# EAGLE design breakout_lpc11c24 (EAGLE 5.12)
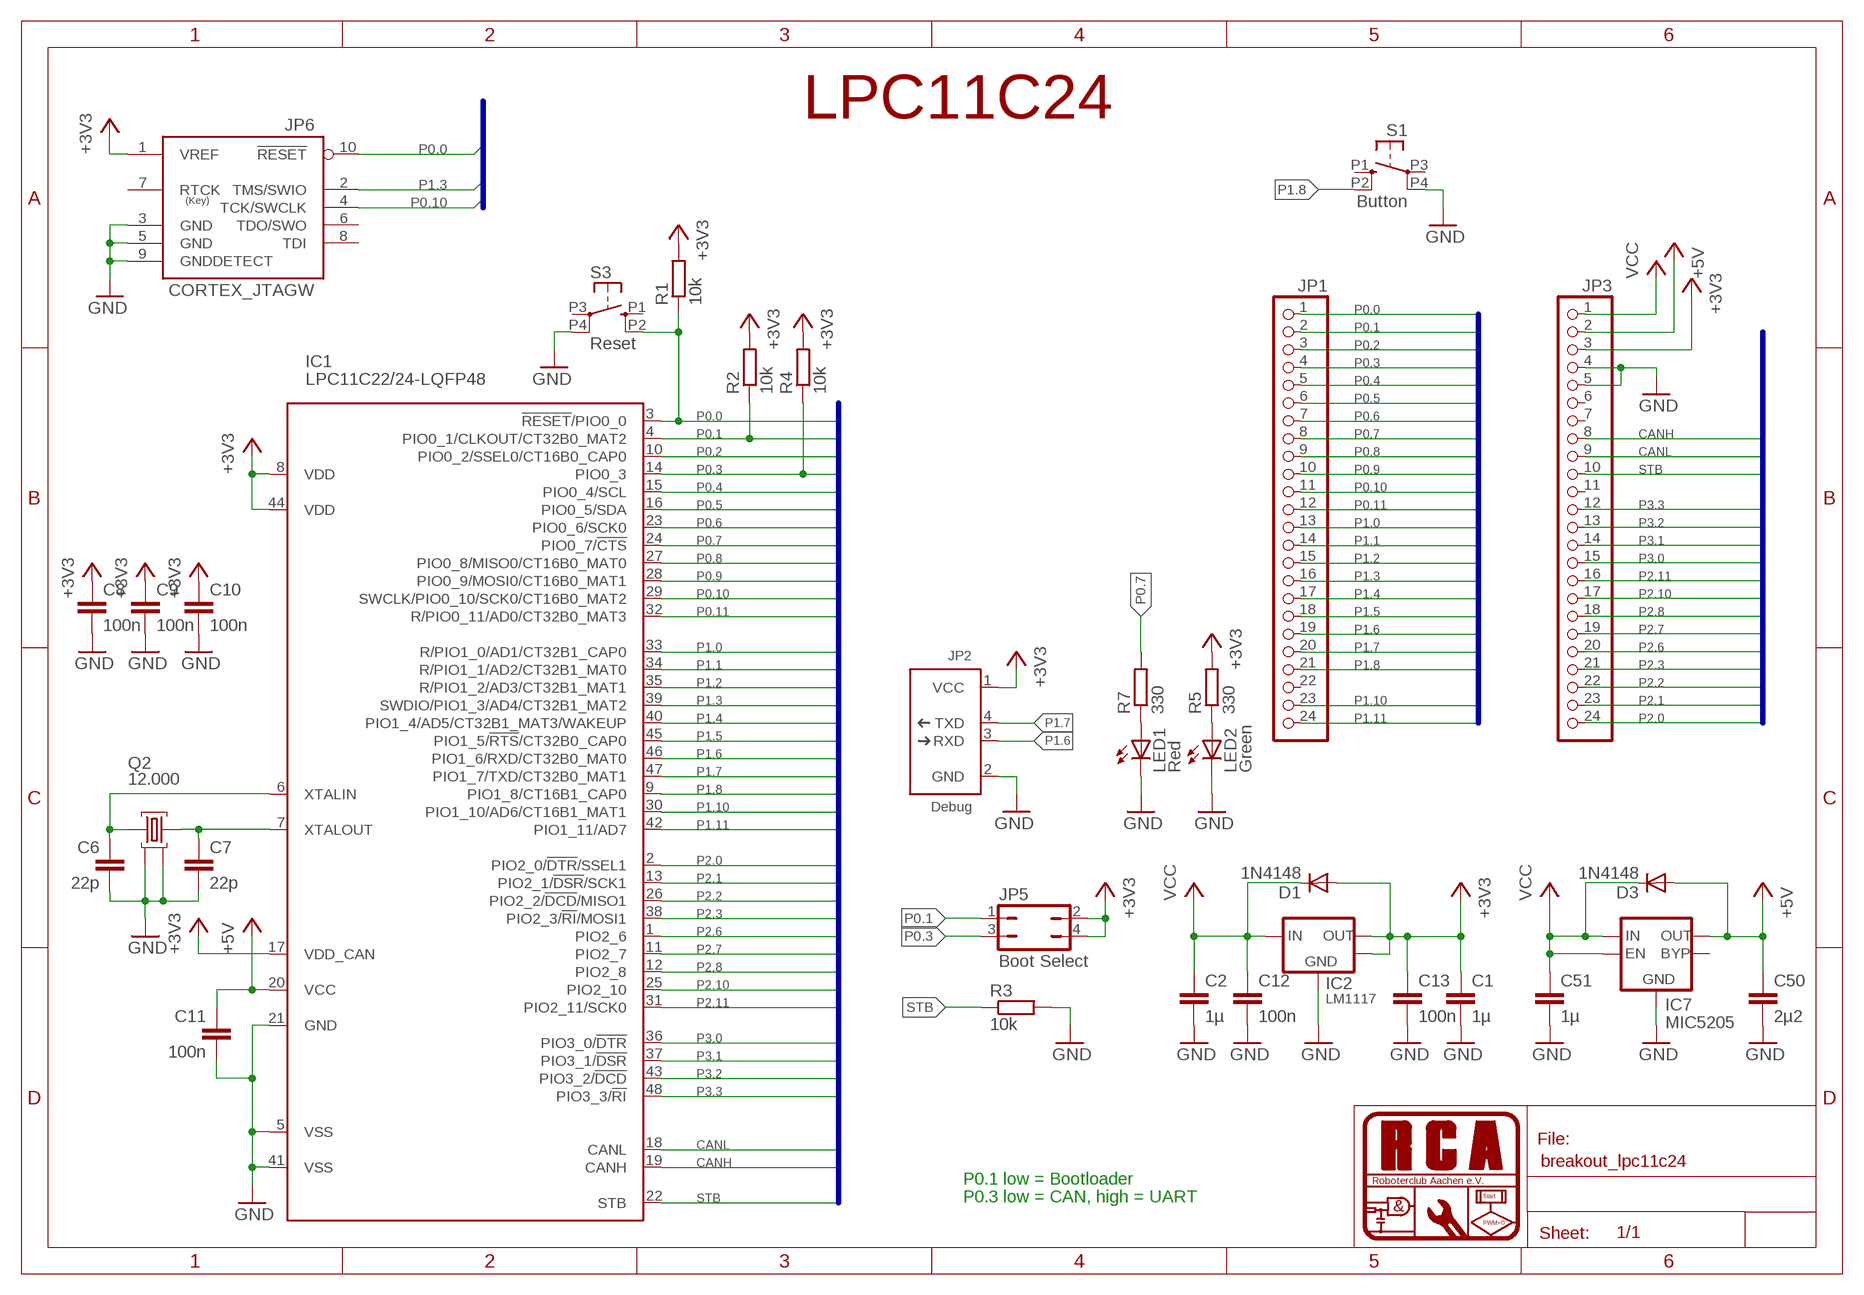
[diagram p0: schematic, sheet 1]

## Parts
C1  1µ  C-EUC0805  [C0805]
C2  1µ  C-EUC0805  [C0805]
C6  22p  C-EUC0805  [C0805]
C7  22p  C-EUC0805  [C0805]
C8  100n  C-EUC0603  [C0603]
C9  100n  C-EUC0603  [C0603]
C10  100n  C-EUC0603  [C0603]
C11  100n  C-EUC0603  [C0603]
C12  100n  C-EUC0603  [C0603]
C13  100n  C-EUC0603  [C0603]
C50  2µ2  C-EUC0805  [C0805]
C51  1µ  C-EUC0805  [C0805]
D1  1N4148  DIODE-SOD80C  [SOD80C]
D3  1N4148  DIODE-SOD80C  [SOD80C]
IC1  LPC11C22/24-LQFP48  [LQFP48]
IC2  LM1117  [SOT223]
IC7  MIC5205  [SOT23-5L]
JP1  PINHD-1X24_2.54  [1X24]
JP2  Debug  SERIAL-DEBUGPSL  [7395-05]
JP3  PINHD-1X24_2.54  [1X24]
JP5  Boot Select  JP2Q  [JP2Q]
JP6  CORTEX_JTAGW  [ML10]
LED1  Red  LEDCHIPLED_0805  [CHIPLED_0805]
LED2  Green  LEDCHIPLED_0805  [CHIPLED_0805]
Q2  12.000  MT  [MT]
R1  10k  R-EU_R0805  [R0805]
R2  10k  R-EU_R0805  [R0805]
R3  10k  R-EU_R0805  [R0805]
R4  10k  R-EU_R0805  [R0805]
R5  330  R-EU_R0805  [R0805]
R7  330  R-EU_R0805  [R0805]
S1  Button  10-XXLSH  [B3F-10XX-SMD]
S3  Reset  10-XXLSH  [B3F-10XX-SMD]

## Nets
+3V3: C1.1 C8.1 C9.1 C10.1 C13.1 D1.A IC1.8(VDD) IC1.17(VDD_CAN) IC1.44(VDD) IC2.2(OUT) IC2.4(OUT) JP2.1(VCC) JP3.3 JP5.2 JP5.4 JP6.1(VREF) R1.2 R2.2 R4.2 R5.2
+5V: C11.1 C50.1 D3.A IC1.20(VCC) IC7.5(OUT) JP3.2
CANH: IC1.19(CANH) JP3.8
CANL: IC1.18(CANL) JP3.9
GND: C1.2 C2.2 C6.2 C7.2 C8.2 C9.2 C10.2 C11.2 C12.2 C13.2 C50.2 C51.2 IC1.5(VSS) IC1.21(GND) IC1.41(VSS) IC2.1(GND) IC7.2(GND) JP2.2(GND) JP3.4 JP3.5 JP6.3(GND) JP6.5(GND) JP6.9(GNDDETECT) LED1.C LED2.C Q2.2(GND) Q2.4(GND) R3.2 S1.P4(P1) S3.P4(P1)
N$1: C7.1 IC1.7(XTALOUT) Q2.3
N$2: LED2.A R5.1
N$4: LED1.A R7.1
N$9: C6.1 IC1.6(XTALIN) Q2.1
P0.0: IC1.3(!RESET!/PIO0_0) JP1.1 JP6.10(!RESET) R1.1 S3.P2(S1)
P0.1: IC1.4(PIO0_1/CLKOUT/CT32B0_MAT2) JP1.2 JP5.1 R2.1
P0.2: IC1.10(PIO0_2/SSEL0/CT16B0_CAP0) JP1.3
P0.3: IC1.14(PIO0_3) JP1.4 JP5.3 R4.1
P0.4: IC1.15(PIO0_4/SCL) JP1.5
P0.5: IC1.16(PIO0_5/SDA) JP1.6
P0.6: IC1.23(PIO0_6/SCK0) JP1.7
P0.7: IC1.24(PIO0_7/!CTS!) JP1.8 R7.2
P0.8: IC1.27(PIO0_8/MISO0/CT16B0_MAT0) JP1.9
P0.9: IC1.28(PIO0_9/MOSI0/CT16B0_MAT1) JP1.10
P0.10: IC1.29(SWCLK/PIO0_10/SCK0/CT16B0_MAT2) JP1.11 JP6.4(TCK/SWCLK)
P0.11: IC1.32(R/PIO0_11/AD0/CT32B0_MAT3) JP1.12
P1.0: IC1.33(R/PIO1_0/AD1/CT32B1_CAP0) JP1.13
P1.1: IC1.34(R/PIO1_1/AD2/CT32B1_MAT0) JP1.14
P1.2: IC1.35(R/PIO1_2/AD3/CT32B1_MAT1) JP1.15
P1.3: IC1.39(SWDIO/PIO1_3/AD4/CT32B1_MAT2) JP1.16 JP6.2(TMS/SWIO)
P1.4: IC1.40(PIO1_4/AD5/CT32B1_MAT3/WAKEUP) JP1.17
P1.5: IC1.45(PIO1_5/!RTS!/CT32B0_CAP0) JP1.18
P1.6: IC1.46(PIO1_6/RXD/CT32B0_MAT0) JP1.19 JP2.3(RXD)
P1.7: IC1.47(PIO1_7/TXD/CT32B0_MAT1) JP1.20 JP2.4(TXD)
P1.8: IC1.9(PIO1_8/CT16B1_CAP0) JP1.21 S1.P2(S1)
P1.10: IC1.30(PIO1_10/AD6/CT16B1_MAT1) JP1.23
P1.11: IC1.42(PIO1_11/AD7) JP1.24
P2.0: IC1.2(PIO2_0/!DTR!/SSEL1) JP3.24
P2.1: IC1.13(PIO2_1/!DSR!/SCK1) JP3.23
P2.2: IC1.26(PIO2_2/!DCD!/MISO1) JP3.22
P2.3: IC1.38(PIO2_3/!RI!/MOSI1) JP3.21
P2.6: IC1.1(PIO2_6) JP3.20
P2.7: IC1.11(PIO2_7) JP3.19
P2.8: IC1.12(PIO2_8) JP3.18
P2.10: IC1.25(PIO2_10) JP3.17
P2.11: IC1.31(PIO2_11/SCK0) JP3.16
P3.0: IC1.36(PIO3_0/!DTR!) JP3.15
P3.1: IC1.37(PIO3_1/!DSR!) JP3.14
P3.2: IC1.43(PIO3_2/!DCD!) JP3.13
P3.3: IC1.48(PIO3_3/!RI!) JP3.12
STB: IC1.22(STB) JP3.10 R3.1
VCC: C2.1 C12.1 C51.1 D1.C D3.C IC2.3(IN) IC7.1(IN) IC7.3(EN) JP3.1
Unconnected: IC7.4(BYP) JP1.22 JP3.6 JP3.7 JP3.11 JP6.6(TDO/SWO) JP6.7(RTCK) JP6.8(TDI) S1.P1(S) S1.P3(P) S3.P1(S) S3.P3(P)

## Buses
P0.[0..11],P1.[0..8],P1.[10..11],P2.[0..3],P2.[6..8],P2.[10..11],P3.[0..3],CANH,CANL,STB

## Notes on the sheet
- LPC11C24
- P0.1 low = Bootloader
- P0.3 low = CAN, high = UART

## Library data of the parts
C1 C2 C6-C13 C50 C51 = rcl:C-EU: CAPACITOR, European symbol
D1 D3 = diode:DIODE-: DIODE
IC1 = lpc1100v1.1:LPC11C22/24-LQFP48: NXP Semiconductors LPC11Cxx microcontrollers <http://ics.nxp.com/products/lpc1000/lpc11xx/lpc11cxx/> ARM 32-bit Cortex-M0 Microcontroller with MPU CPU clock up to 50MHz 32KByte on-chip Flash ROM with In-System Programming (ISP) and In-Application Programming (IAP) via On-Chip Bootloader 8KByte SRAM Nested Vectored Interrupt Controller 2 SPI controllers CAN controller On-chip, high-speed CAN transciever UART with full Modem Interface and RS485 Support Fast Mode I2C-Bus 4 Timers with 4 capture channels and 12 output channels Watchdog (WDT) Sytem tick timer 10-bit ADC with 8 channels Power Management Unit (PMU) Brownout detection 12MHz internal RC oscillator Serial Wire Debug/Trace port
IC2 = rca_spgversorgung:LM1117: LM1117 800mA Low-Dropout Linear Regulator
IC7 = rca_spgversorgung:MIC5205: MIC5205 150mA Low-Noise LDO Regulator The MIC5205 is an efficient linear voltage regulator with ultra low-noise output, very low dropout voltage (typically 17mV at light loads and 165mV at 150mA), and very low ground current (600µA at 100mA output). The MIC5205 offers better than 1% initial accuracy.
JP1 JP3 = pinhead2:PINHD-1X24: PIN HEADER
JP2 = rca_stecker:SERIAL-DEBUG: Serieller Debugging Stecker Die RXD und TXD Leitungen sollten 5V Pegel haben
JP5 = jumper:JP2Q: JUMPER
JP6 = rca_stecker:CORTEX_JTAG
LED1 LED2 = led:LED: LED OSRAM: - CHIPLED LG R971, LG N971, LY N971, LG Q971, LY Q971, LO R971, LY R971 LH N974, LH R974 LS Q976, LO Q976, LY Q976 LO Q996 - Hyper CHIPLED LW Q18S LB Q993, LB Q99A, LB R99A - SideLED LS A670, LO A670, LY A670, LG A670, LP A670 LB A673, LV A673, LT A673, LW A673 LH A674 LY A675 LS A676, LA A676, LO A676, LY A676, LW A676 LS A679, LY A679, LG A679 - Hyper Micro SIDELED® LS Y876, LA Y876, LO Y876, LY Y876 LT Y87S - SmartLED LW L88C, LW L88S LB L89C, LB L89S, LG L890 LS L89K, LO L89K, LY L89K LS L896, LA L896, LO L896, LY L896 - TOPLED LS T670, LO T670, LY T670, LG T670, LP T670 LSG T670, LSP T670, LSY T670, LOP T670, LYG T670 LG T671, LOG T671, LSG T671 LB T673, LV T673, LT T673, LW T673 LH T674 LS T676, LA T676, LO T676, LY T676, LB T676, LH T676, LSB T676, LW T676 LB T67C, LV T67C, LT T67C, LS T67K, LO T67K, LY T67K, LW E67C LS E67B, LA E67B, LO E67B, LY E67B, LB E67C, LV E67C, LT E67C LW T67C LS T679, LY T679, LG T679 LS T770, LO T770, LY T770, LG T770, LP T770 LB T773, LV T773, LT T773, LW T773 LH T774 LS E675, LA E675, LY E675, LS T675 LS T776, LA T776, LO T776, LY T776, LB T776 LHGB T686 LT T68C, LB T68C - Hyper Mini TOPLED® LB M676 - Mini TOPLED Santana® LG M470 LS M47K, LO M47K, LY M47K Source: http://www.osram.convergy.de LUXEON: - LUMILED® LXK2-PW12-R00, LXK2-PW12-S00, LXK2-PW14-U00, LXK2-PW14-V00 LXK2-PM12-R00, LXK2-PM12-S00, LXK2-PM14-U00 LXK2-PE12-Q00, LXK2-PE12-R00, LXK2-PE12-S00, LXK2-PE14-T00, LXK2-PE14-U00 LXK2-PB12-K00, LXK2-PB12-L00, LXK2-PB12-M00, LXK2-PB14-N00, LXK2-PB14-P00, LXK2-PB14-Q00 LXK2-PR12-L00, LXK2-PR12-M00, LXK2-PR14-Q00, LXK2-PR14-R00 LXK2-PD12-Q00, LXK2-PD12-R00, LXK2-PD12-S00 LXK2-PH12-R00, LXK2-PH12-S00 LXK2-PL12-P00, LXK2-PL12-Q00, LXK2-PL12-R00 Source: www.luxeon.com KINGBRIGHT: KA-3528ASYC Source: www.kingbright.com
Q2 = rca_sontiges:MT: MT Crystals from Euroquartz UNTESTED Ultra-miniature (2.5mm x 3.2mm) AT-cut crystals covering the frequency range 12 MHz to 60MHz in fundamental mode and up to 150 MHz in 3rd octave mode. Features Euroquartz Datasheet MT Crystal <http://www.euroquartz.co.uk/Portals/0/mt.pdf> Fundamental Frequency Calibration Tolerance: +/- 30ppm Frequency Stability: +/- 30ppm Load Capacitancy: 12pF typ. Ordering Distributed by Reichelt as "Keramik-SMD-Quarz 2,5x3,2x0,7mm". Reichelt: $(VALUE)-MT Available Frequncies at Reichelt's 12.000000 MHz 14.318180 MHz 14.745600 MHz 16.000000 MHz 16.384000 MHz 18.432000 MHz 20.000000 MHz 24.000000 MHz 24.576000 MHz 25.000000 MHz Status 2011-11 Added by Sascha, untested.
R1-R5 R7 = rcl:R-EU_: RESISTOR, European symbol
S1 S3 = rca_sontiges:10-XX*: OMRON SWITCH

## Board
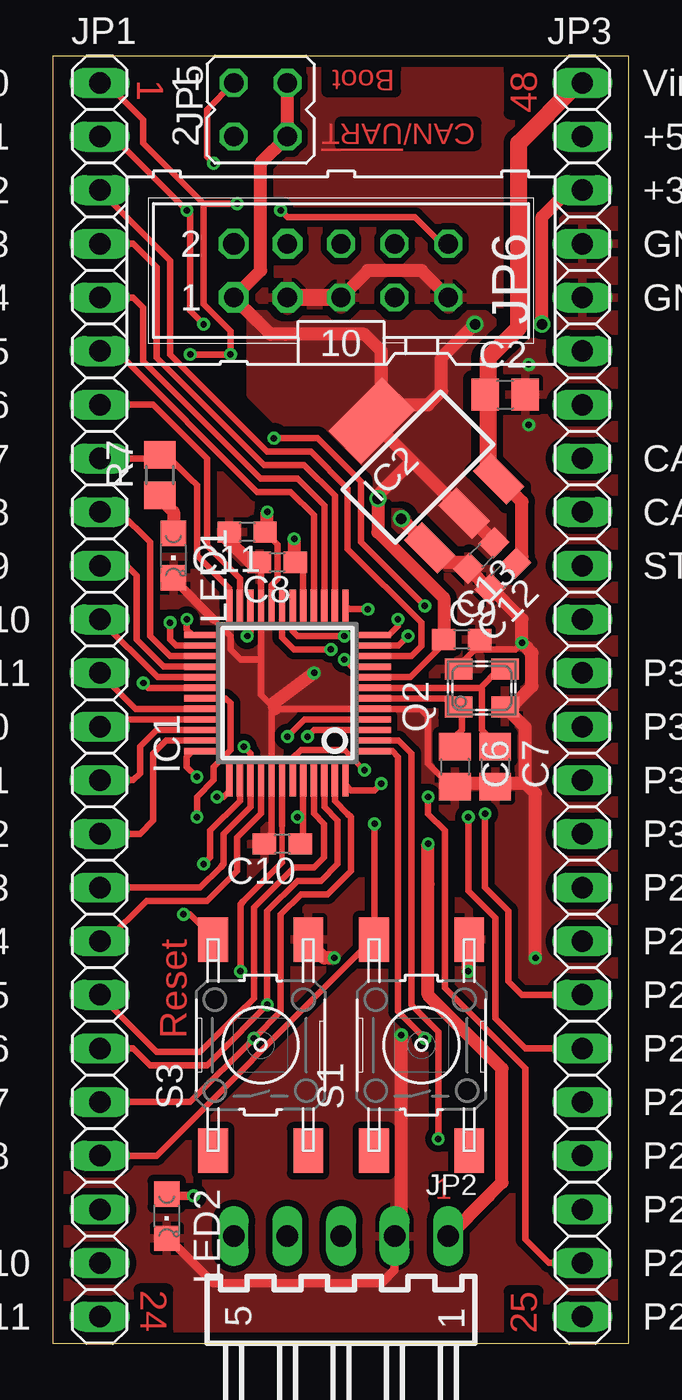
[diagram p1: board, top side]
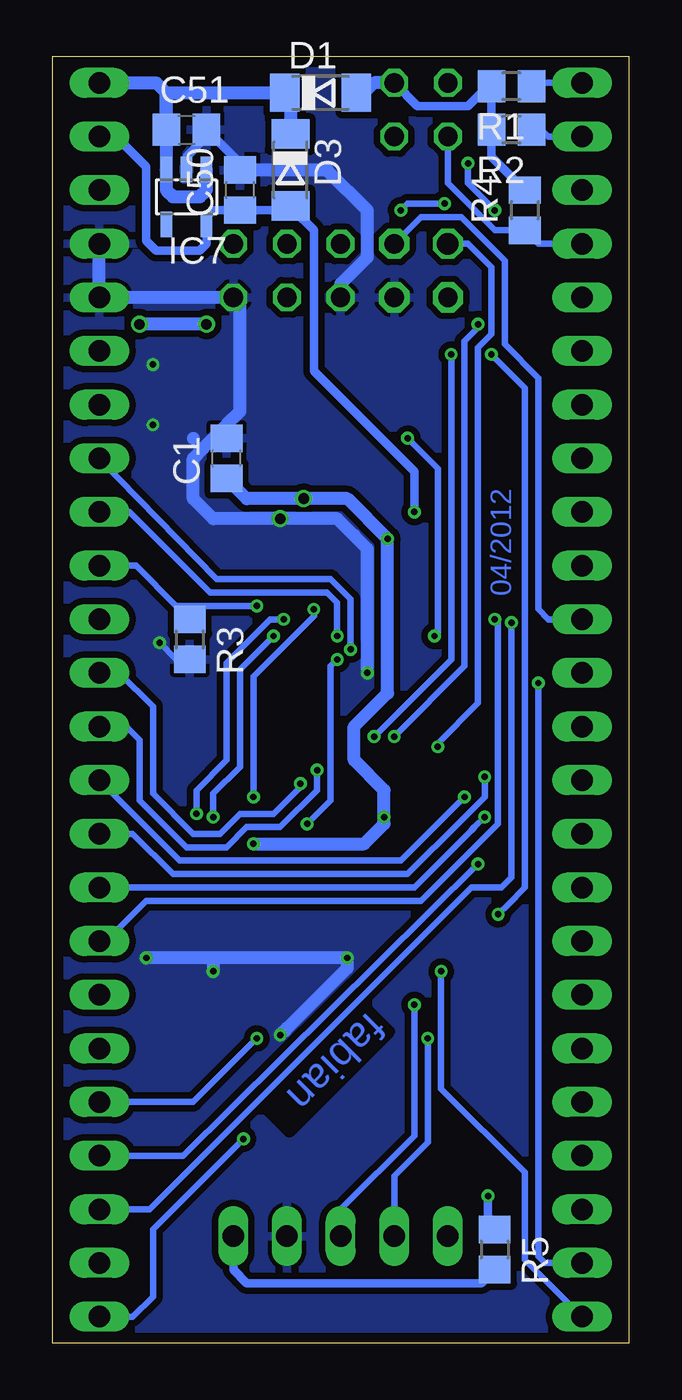
[diagram p2: board, bottom side, seen from below]

Size 27.29 x 60.95 mm. Coordinates in mm from the lower left corner, seen from the top.
Outline: 0,0 27.28,0 27.28,60.95 0,60.95 0,0
Copper layers (1*16): Top 0.035mm / dielectric 1.5mm / Bottom 0.035mm
Design rules "PCB-POOL": minimum track width 6mil, minimum drill 12mil, track to track 6mil, track to pad 6mil, pad to pad 6mil, via to via 6mil, smd to smd 6mil, copper to edge 20mil, drill to drill 8mil, minimum pad ring 8mil, minimum via ring 6mil, stop-mask expansion 3mil, vias tented up to drill 0mil, thermal gap 8mil

### Footprints (pad centres in the part's own frame; a part is rotated, then mirrored left to right if it is on the bottom)
C0805 = smd 1.3 x 1.5: 1 -0.95,0; 2 0.95,0
C0603 = smd 1.1 x 1: 1 -0.85,0; 2 0.85,0
SOD80C = smd 1.4 x 1.8: A 1.7,0; C -1.7,0
LQFP48 = smd 0.3 x 1.6: 1 -2.75,-4.1; 2 -2.25,-4.1; 3 -1.75,-4.1; 4 -1.25,-4.1; 5 -0.75,-4.1; 6 -0.25,-4.1; 7 0.25,-4.1; 8 0.75,-4.1; 9 1.25,-4.1; 10 1.75,-4.1; 11 2.25,-4.1; 12 2.75,-4.1; 25 2.75,4.1; 26 2.25,4.1; 27 1.75,4.1; 28 1.25,4.1; 29 0.75,4.1; 30 0.25,4.1; 31 -0.25,4.1; 32 -0.75,4.1; 33 -1.25,4.1; 34 -1.75,4.1; 35 -2.25,4.1; 36 -2.75,4.1 | smd 1.6 x 0.3: 13 4.1,-2.75; 14 4.1,-2.25; 15 4.1,-1.75; 16 4.1,-1.25; 17 4.1,-0.75; 18 4.1,-0.25; 19 4.1,0.25; 20 4.1,0.75; 21 4.1,1.25; 22 4.1,1.75; 23 4.1,2.25; 24 4.1,2.75; 37 -4.1,2.75; 38 -4.1,2.25; 39 -4.1,1.75; 40 -4.1,1.25; 41 -4.1,0.75; 42 -4.1,0.25; 43 -4.1,-0.25; 44 -4.1,-0.75; 45 -4.1,-1.25; 46 -4.1,-1.75; 47 -4.1,-2.25; 48 -4.1,-2.75
SOT223 = smd 1.219 x 2.235: 1 -2.311,-3.099; 2 0,-3.099; 3 2.311,-3.099 | smd 3.6 x 2.2: 4 0,3.099
SOT23-5L = smd 0.55 x 1.2: 1 -0.95,-1.3; 2 0,-1.3; 3 0.95,-1.3; 4 0.95,1.3; 5 -0.95,1.3
1X24 = drill 1.016 long: 1 -29.21,0; 2 -26.67,0; 3 -24.13,0; 4 -21.59,0; 5 -19.05,0; 6 -16.51,0; 7 -13.97,0; 8 -11.43,0; 9 -8.89,0; 10 -6.35,0; 11 -3.81,0; 12 -1.27,0; 13 1.27,0; 14 3.81,0; 15 6.35,0; 16 8.89,0; 17 11.43,0; 18 13.97,0; 19 16.51,0; 20 19.05,0; 21 21.59,0; 22 24.13,0; 23 26.67,0; 24 29.21,0
7395-05 = drill 1.016 long: 1 -5.08,0; 2 -2.54,0; 3 0,0; 4 2.54,0; 5 5.08,0
JP2Q = drill 0.914 octagon: 1 -1.27,-1.27; 2 -1.27,1.27; 3 1.27,-1.27; 4 1.27,1.27
ML10 = drill 0.914 pad 1.422 octagon: 1 -5.08,-1.27; 3 -2.54,-1.27; 4 -2.54,1.27 | drill 1.016 pad 1.422 octagon: 2 -5.08,1.27 | drill 0.914 octagon: 5 0,-1.27; 6 0,1.27; 7 2.54,-1.27; 8 2.54,1.27; 9 5.08,-1.27; 10 5.08,1.27
CHIPLED_0805 = smd 1.2 x 1.2: A 0,-1.05; C 0,1.05
MT = smd 1.3 x 1: 1 -1.1,-0.9; 2 1.1,-0.9; 3 1.1,0.9; 4 -1.1,0.9
R0805 = smd 1.3 x 1.5: 1 -0.95,0; 2 0.95,0
B3F-10XX-SMD = smd 2.1 x 1.4: P1 -5,2.25; P2 5,2.25; P3 -5,-2.25; P4 5,-2.25

### Placement (x,y rotation side)
C1  19.05,41.91 90 bottom
C2  21.43,44.93 0 top
C6  19.05,27.3 270 top
C7  20.96,27.3 270 top
C8  10.64,36.99 180 top
C9  19.37,33.34 0 top
C10  10.87,23.65 180 top
C11  9.21,38.42 180 top
C12  21.32,36.33 225 top
C13  20.29,37.31 225 top
C50  18.42,54.61 90 bottom
C51  20.96,57.47 0 bottom
D1  14.6,59.21 0 bottom
D3  16.03,55.56 270 bottom
IC1  11.11,30.8 90 top
IC2  17.29,41.5 45 top
IC7  20.96,54.29 180 bottom
JP1  2.22,30.48 270 top
JP2  13.65,5.08 180 top
JP3  25.08,30.48 270 top
JP5  9.84,58.42 270 top
JP6  13.65,50.8 0 top
LED1  5.72,37.31 180 top
LED2  5.4,6.03 180 top
Q2  20.32,31.04 0 top
R1  5.56,59.53 180 bottom
R2  5.56,57.47 180 bottom
R3  20.8,33.34 270 bottom
R4  4.92,53.66 90 bottom
R5  6.35,4.45 270 bottom
R7  5.08,41.12 90 top
S1  17.46,14.13 90 top
S3  9.84,14.13 90 top

### Tracks (layer width: path | path; a pad name or v marks a point on that pad's centre or on a via)
+3V3  (via drill 0.3, 0.5)
  Top 0.305: C10.1 11.86,24.03 IC1.44 11.86,25.2 v11.59,24.92 | IC1.17 11.86,36.93 C8.1 | IC1.8 16.94,31.55 18.42,33.02 18.42,33.23 C9.1
  Top 0.61: JP2.1 20.64,6.99 21.27,7.62 21.27,13.02 17.78,16.51 17.78,21.75 v17.78,23.65 | v17.78,23.65 | 17.01,41.78 IC2.2 19.59,39.31 20.8,38.1 20.8,37.69 C13.1 | 17.01,41.78 IC2.4 15.08,43.66 15.56,44.13 15.56,44.45 | C9.1 18.52,35.3 15.4,38.42 v15.4,40.01 15.4,40.16 17.01,41.78 | C8.1 11.43,36.99 v11.43,38.1 | JP5.2 JP5.4 9.84,55.88 9.84,50.8 JP6.1 9.68,48.42 10.32,47.78 11.01,47.78 14.76,47.78 15.56,46.99 15.56,44.45 | JP3.3 24.45,54.61 23.18,53.34 v23.18,48.26 | v20,48.26 18.42,46.67 18.42,45.09 17.78,44.45 15.56,44.45
  Bottom 0.406: JP5.2 10,58.58 7.62,58.58 6.67,59.53 R1.2 R2.2 6.51,56.19 R4.2 | JP2.1 18.73,3.49 18.1,2.86 6.99,2.86 R5.2
  Bottom 0.61: v17.78,23.65 12.54,23.65 11.59,24.61 v11.59,24.92 11.59,26.19 13.02,27.62 13.02,29.21 11.43,30.8 v11.43,38.1 13.33,40.01 v15.4,40.01 18.1,40.01 C1.1 | v20,48.26 v23.18,48.26 | D1.A 12.54,59.21 12.07,59.69 JP5.2
  pour Top (isolate 0.406, no thermals): 9.37,48.74 9.37,44.93 10.79,43.5 12.7,43.5 15.24,40.96 15.24,40.16 16.03,40.16 16.83,39.37 16.83,39.37 19.21,36.99 20.64,36.99 21.75,38.1 21.75,40.48 20.96,41.27 20.96,48.26 20.48,48.74
+5V  (via drill 0.3)
  Top 0.305: IC1.20 10.36,35.92 10.64,36.2 10.64,37.84 C11.1
  Top 0.61: C11.1 10.16,38.42 v10.16,39.37
  Bottom 0.406: v10.16,39.37 10.16,41.27 14.92,46.04 14.92,52.7 15.87,53.66 16.19,53.66 18.1,53.66 C50.1 | C50.1 18.57,53.66 | JP3.2 24.29,57.15 22.86,55.72 22.86,52.23 22.38,51.75 20.32,51.75 20.01,52.07 IC7.5 19.98,53.02 19.98,53.37 19.69,53.66 C50.1
  Bottom 0.61: D3.A 16.35,53.82 16.19,53.66
CANH  (via drill 0.3)
  Top 0.305: IC1.19 10.86,33.43 11.43,32.86 v13.18,32.86
  Bottom 0.305: v13.18,32.86 13.18,35.24 14.13,36.2 19.53,36.2 JP3.8
CANL  (via drill 0.3)
  Top 0.305: IC1.18 11.36,33.72 11.59,33.5 v13.81,33.5
  Bottom 0.305: v13.81,33.5 13.81,35.08 14.29,35.56 19.84,35.56 23.65,39.37 JP3.9
GND  (via drill 0.3, 0.5)
  Top 0.254: 7.62,34.29 8.25,33.66 8.26,33.66 8.41,33.5
  Top 0.305: 10.52,30.05 IC1.5 17.42,30.05 17.78,29.69 17.78,27.46 19.05,26.19 19.21,26.51 C6.2 19.37,26.51 | 10.52,30.05 10.36,29.89 IC1.41 10.36,24.17 10,23.81 C10.2 | 9.86,32.38 9.86,30.71 10.52,30.05 | 9.86,32.38 IC1.21 9.86,36.59 C8.2 | 21.12,26.51 C7.2 20.96,26.51 20.64,26.51 | Q2.4 19.08,31.94 20,32.86 20.32,32.86 | 22.38,33.02 22.07,33.02 21.91,32.86 20.32,32.86 | 21.91,30.32 21.61,30.32 Q2.2 | 12.22,18.89 12.07,19.16 S3.P4 | C9.2 20.32,33.34 20.32,32.86 | S1.P4 19.71,19.08 19.69,19.05 | 8.41,33.5 8.41,32.86 8.89,32.38 9.86,32.38 | JP2.2
  Top 0.406: LED1.C 5.72,36.2 7.62,34.29 | LED2.C 5.49,4.98 7.62,2.86 15.56,2.86 16.19,3.49 JP2.2
  Top 0.61: 21.12,26.51 19.37,26.51 | 20.64,26.51 20.96,26.51 22.38,26.51 | 22.38,26.51 22.38,26.99 22.38,29.17 Q2.2 | 21.91,30.32 22.7,31.11 22.7,32.7 22.38,33.02 v22.23,33.18 22.23,34.29 20.64,35.88 | v13.33,18.26 12.86,18.26 12.22,18.89 | v16.51,14.61 16.51,5.4 JP2.2 | 10.52,30.05 | 10.52,30.05 10.48,30.32 v12.38,31.75 | C8.2 9.37,36.99 8.25,38.1 8.41,38.36 C11.2 | 22.38,26.51 | 22.38,26.51 22.86,26.04 v22.86,18.26 | C12.2 20.66,35.73 C13.2 19.57,36.99 18.57,36.99 17.89,37.67 IC2.1 17.46,38.06 17.46,38.1 v16.51,39.05 | JP6.5 14.92,50.8 17.46,50.8 JP6.9 | v19.69,17.62 19.69,19.05
  Top 0.813: JP6.5 JP6.3
  Bottom 0.305: R3.2 21.43,32.39 v22.23,33.18
  Bottom 0.406: IC7.2 20.96,56.2 20.32,56.83 20.32,57.15 C51.2 18.42,55.88 C50.2
  Bottom 0.61: v16.51,14.61 16.19,14.92 13.33,17.78 v13.33,18.26 19.69,18.26 | v12.38,31.75 12.38,37.62 13.02,38.26 13.81,39.05 | 19.69,18.26 v22.86,18.26 | 13.81,39.05 | 13.81,39.05 v16.51,39.05 19.69,39.05 20.64,40.01 20.64,41.91 20.16,42.39 19.21,43.34 19.05,43.5 | JP3.4 JP3.5 JP6.9 18.42,49.21 18.42,44.13 19.05,43.5 | 19.69,18.26 v19.69,17.62 | C50.2 14.29,55.56 12.38,53.66 12.38,51.44 13.65,50.16 JP6.5 | 20.64,42.86 | 19.05,43.5 C1.2
  other vias: 22.54,46.35 22.54,43.5
  pour Bottom (isolate 0.305, rank 6): -1.59,62.23 28.89,62.23 28.89,-1.27 -1.59,-1.27
  pour Top (isolate 0.305, rank 6): -2.86,-2.54 -2.86,63.5 30.16,63.5 30.16,-2.54
  pour Top (isolate 0.305): 7.3,26.83 7.3,34.77 14.92,34.77 14.92,26.83
N$1
  Top 0.305: 20.23,31.05 20.25,31.05 21.11,31.91 Q2.3 | IC1.7 20.23,31.05 | 20.23,31.05 20.32,30.96 20.32,29.05 21.27,28.1 C7.1
N$2  (via drill 0.3)
  Top 0.406: v6.67,6.99 5.49,6.99 LED2.A
  Bottom 0.406: R5.1 6.35,5.71 6.67,6.03 v6.67,6.99
N$4
  Top 0.61: R7.1 5.08,40.01 5.71,39.37 LED1.A
N$9
  Top 0.305: IC1.6 18.81,30.55 Q2.1 19.22,29.99 19.37,29.84 19.37,29.05 19.05,28.73 C6.1
P0.0  (via drill 0.3)
  Top 0.305: IC1.3 12.38,29.05 v12.07,28.73 | 7.14,53.98 7.14,49.21 8.41,47.94 v8.41,46.83 v6.51,46.83 | 7.14,53.98 4.29,56.83 4.29,57.94 2.54,59.69 JP1.1 | S3.P2 7.59,19.08 7.46,19.37 6.51,20.32 v6.19,20.32 | JP6.10 18.42,52.07 17.14,53.34 11.11,53.34 v10.8,53.66 | 7.14,53.98 v8.73,53.98
  Bottom 0.305: v12.07,28.73 v12.06,28.73 11.91,28.89 8.41,32.38 v8.41,46.83 | v6.19,20.32 | v6.19,20.32 5.72,20.8 5.71,20.8 4.92,21.59 4.92,33.18 4.92,33.34 4.92,45.24 v6.51,46.83 | JP1.1 4.45,59.69 | v10.8,53.66 10.48,53.98 v8.73,53.98
  Bottom 0.406: R1.1 4.45,59.69
P0.1  (via drill 0.3)
  Top 0.305: IC1.4 11.93,29.55 v11.11,28.73 | v7.14,48.26 6.51,48.9 6.51,53.5 v6.35,53.66 | v6.35,53.66 | v6.35,53.66 2.86,57.15 JP1.2 | JP5.1 7.3,58.42 7.3,56.2 v7.62,55.88
  Bottom 0.305: v11.11,28.73 | v11.11,28.73 7.78,32.07 7.78,47.47 7.14,48.1 v7.14,48.26 | JP1.2 3.81,57.15 4.29,57.63 4.61,57.63 R2.1 | v7.62,55.88 7.62,54.93 v6.35,53.66
P0.2
  Top 0.305: IC1.10 16.99,32.55 17.46,33.02 17.46,34.13 13.97,37.62 13.97,40.48 12.22,42.23 10.16,42.23 5.56,46.83 5.56,51.28 JP1.3
P0.3
  Top 0.305: IC1.14 13.36,40.14 11.91,41.59 10,41.59 4.92,46.67 4.92,50.96 3.81,52.07 JP1.4
  Bottom 0.305: JP5.3 8.57,54.93 6.35,52.7 R4.1 | R4.1 | R4.1 4.29,52.07 JP1.4
P0.4
  Top 0.305: IC1.15 12.86,39.68 11.59,40.96 9.84,40.96 4.29,46.51 4.29,49.05 3.81,49.53 JP1.5
P0.5
  Top 0.305: IC1.16 12.36,39.23 11.27,40.32 9.68,40.32 3.02,46.99 JP1.6
P0.6
  Top 0.305: IC1.23 8.86,36.22 7.3,37.78 7.3,41.91 6.96,42.26 6.8,42.41 4.76,44.45 4.13,44.45 JP1.7
P0.7
  Top 0.305: IC1.24 8.36,35.77 6.83,37.31 6.83,40.64 6.51,40.96 5.56,41.91 5.08,41.91 | 5.08,41.91 JP1.8 | 5.08,41.91 R7.2
P0.8
  Top 0.305: IC1.27 5.55,32.55 4.6,33.5 4.6,37.94 3.18,39.37 JP1.9
P0.9
  Top 0.305: IC1.28 5.26,32.05 3.97,33.34 3.97,36.35 3.49,36.83 JP1.10
P0.10
  Top 0.305: IC1.29 4.96,31.55 JP1.11
  Bottom 0.305: JP1.11 3.81,34.29 4.29,34.77 4.29,45.72 5.87,47.31 5.87,51.28 7.94,53.34 9.84,53.34 JP6.4
P0.11
  Top 0.305: IC1.32 3.92,30.05 JP1.12
P1.0
  Top 0.305: IC1.33 2.56,29.55 JP1.13
P1.1
  Top 0.305: IC1.34 4.92,29.05 4.13,28.26 4.13,26.99 3.81,26.67 JP1.14
P1.2
  Top 0.305: IC1.35 5.37,28.55 4.76,27.94 4.76,24.77 4.13,24.13 JP1.15
P1.3  (via drill 0.3)
  Top 0.305: JP1.16 6.99,21.59 7.94,22.54 | 7.94,22.54 | 7.94,22.54 8.1,22.7 8.1,24.13 9.36,25.4 IC1.39 9.36,27.94 v9.05,28.26
  Bottom 0.305: v9.05,28.26 9.05,28.42 7.14,30.32 7.14,45.72 7.14,47.15 6.51,47.78 6.51,50.96 7.62,52.07 JP6.2
P1.4
  Top 0.305: JP1.17 2.54,19.05 4.45,20.95 7.3,20.95 8.73,22.38 8.73,23.97 9.86,25.1 IC1.40
P1.5
  Top 0.305: JP1.18 4.92,13.81 6.99,13.81 8.73,15.56 | 8.73,15.56 | 8.73,15.56 9.52,16.35 9.52,20.64 11.09,22.2 11.25,22.36 11.43,22.54 12.38,22.54 12.86,23.02 12.86,24.61 12.36,25.1 IC1.45
P1.6  (via drill 0.3)
  Top 0.305: JP1.19 3.81,13.97 4.6,13.18 7.3,13.18 7.78,13.65 | 7.78,13.65 | IC1.46 12.86,25.4 13.49,24.77 13.49,22.7 12.7,21.91 11.59,21.91 10.16,20.48 v10.16,16.03 7.78,13.65
  Bottom 0.305: JP2.3 13.65,6.35 10.16,9.84 v10.16,16.03
P1.7  (via drill 0.3)
  Top 0.305: IC1.47 13.36,25.69 13.97,25.08 14.13,24.92 14.13,22.38 13.02,21.27 11.75,21.27 10.8,20.32 10.8,15.72 v9.52,14.45 6.51,11.43 JP1.20
  Bottom 0.305: v9.52,14.45 9.52,9.53 11.11,7.94 JP2.4
P1.8  (via drill 0.3)
  Top 0.305: JP1.21 4.6,8.89 4.92,8.89 13.97,17.94 | 13.97,17.94 | 13.97,17.94 15.24,19.21 15.24,19.37 | 15.24,19.37 v15.24,24.61 | IC1.9 14.15,32.05 v13.81,32.38 | S1.P2 15.21,19.34 15.24,19.37
  Bottom 0.305: v15.24,24.61 14.13,25.72 14.13,32.07 v13.81,32.38 | v13.81,32.38
P1.10  (via drill 0.3)
  Top 0.305: IC1.30 4.51,31.05 v4.29,31.27
  Bottom 0.305: v4.29,31.27 4.29,4.13 3.97,3.81 JP1.23
P1.11  (via drill 0.3)
  Top 0.254: 10.86,22.77 10.86,24.54
  Top 0.305: 9.05,20.95 10.86,22.77 | 9.05,20.95 | 9.05,20.95 8.89,20.8 v8.89,17.62 | 10.86,24.54 IC1.42
  Bottom 0.305: v8.89,17.62 8.89,12.06 4.92,8.1 4.92,3.97 JP1.24
P2.0  (via drill 0.3)
  Top 0.305: IC1.2 16.38,28.55 16.99,27.94 16.99,16.03 18.26,14.76 18.26,14.29 v18.26,9.68
  Bottom 0.305: JP3.24 23.49,1.27 22.54,2.22 22.54,5.4 v18.26,9.68
P2.1  (via drill 0.3)
  Top 0.305: JP3.23 23.49,3.81 22.38,4.92 22.38,12.86 22.38,13.02 18.57,16.83 18.57,24.29 17.78,25.08 v17.78,25.88 | v14.92,34.77 14.05,34.77 IC1.13
  Bottom 0.305: v17.78,25.88 17.78,31.59 14.92,34.45 v14.92,34.77
P2.2  (via drill 0.3)
  Top 0.305: v5.56,34.13 5.56,33.34 5.85,33.05 IC1.26
  Bottom 0.305: v5.56,34.13 5.56,33.81 5.56,33.5 5.56,22.07 6.03,21.59 7.46,21.59 22.54,6.51 22.7,6.35 JP3.22
P2.3  (via drill 0.3)
  Top 0.305: IC1.38 8.86,25.69 7.46,24.29 7.46,23.02 v7.14,22.7 | v7.14,22.7
  Bottom 0.305: v7.14,22.7 21.11,8.89 JP3.21
P2.6  (via drill 0.3)
  Top 0.305: IC1.1 16.08,28.05 16.35,27.78 16.35,15.72 v17.62,14.45
  Bottom 0.305: v17.62,14.45 20.64,11.43 JP3.20
P2.7  (via drill 0.3)
  Top 0.305: IC1.11 16.38,33.05 v16.83,33.5 | JP3.19 22.38,13.97 20.96,15.4 20.96,20.16 19.69,21.43 v19.69,24.92
  Bottom 0.305: v19.69,24.92 19.69,26.04 18.42,27.3 18.42,31.91 v16.83,33.5
P2.8  (via drill 0.3)
  Top 0.305: IC1.12 15.93,33.55 16.19,33.81 | 16.19,33.81 | 16.19,33.81 16.35,33.97 v16.35,34.29 | JP3.18 22.23,16.51 21.59,17.14 21.59,20.48 20.48,21.59 v20.48,25.08
  Bottom 0.305: v20.48,25.08 20.48,26.19 19.05,27.62 19.05,32.23 16.99,34.29 v16.35,34.29
P2.10  (via drill 0.3)
  Top 0.305: IC1.25 6.62,33.55 6.35,33.81 v6.35,34.29
  Bottom 0.305: v6.35,34.29 6.19,34.13 6.19,24.61 7.14,23.65 7.3,23.5 9.84,20.95 22.86,20.95 24.76,19.05 JP3.17
P2.11  (via drill 0.3)
  Top 0.254: 7.78,27.46 8.25,27.94
  Top 0.305: IC1.31 8.19,30.55 8.41,30.32 8.41,28.1 8.25,27.94 | 7.78,27.46 7.62,27.3 7.62,26.67 6.83,25.88 v6.83,24.92
  Bottom 0.305: v6.83,24.92 7.3,24.45 7.46,24.29 7.62,24.13 10.16,21.59 JP3.16
P3.0  (via drill 0.3)
  Top 0.305: IC1.36 6.62,28.05 6.35,27.78 6.35,27.3 v6.83,26.83
  Bottom 0.305: v6.83,26.83 6.83,25.88 7.94,24.77 10.48,22.23 21.59,22.23 23.49,24.13 JP3.15
P3.1  (via drill 0.3)
  Top 0.305: IC1.37 8.36,26.14 8.1,25.88 v7.78,25.88
  Bottom 0.305: v7.78,25.88 8.25,25.4 10.8,22.86 21.27,22.86 JP3.14
P3.2  (via drill 0.3)
  Top 0.254: 13.81,28.1 14.6,27.3
  Top 0.305: IC1.43 11.36,27.71 11.75,28.1 13.81,28.1 | 14.6,27.3 v14.76,27.15 | v14.76,27.15
  Bottom 0.305: v14.76,27.15 14.76,26.19 16.51,24.45 18.1,24.45 19.05,23.5 20.96,23.5 23.18,25.72 23.18,28.57 23.81,29.21 JP3.13
P3.3  (via drill 0.3)
  Top 0.305: 13.86,26.88 IC1.48 13.86,26.46 14.13,26.19 15.24,26.19 v15.56,26.51
  Bottom 0.305: v15.56,26.51 15.56,26.35 16.83,25.08 18.42,25.08 19.37,24.13 20.64,24.13 22.54,26.04 22.54,30.16 24.13,31.75 JP3.12
STB  (via drill 0.3)
  Top 0.305: IC1.22 9.36,33.65 v9.21,33.5 | v10.48,42.86 12.54,42.86 14.6,40.8 14.6,37.94 v17.62,34.92
  Bottom 0.305: v9.21,33.5 9.05,33.66 9.05,41.43 v10.48,42.86 | v17.62,34.92 20.48,34.92 | 20.48,34.92 21.43,34.92 23.34,36.83 JP3.10 | R3.1 20.8,34.61 20.48,34.92
VCC
  Top 0.61: C12.1 22.23,37.24 22.23,39.85 IC2.3 | C2.1 20.64,44.77
  Top 0.813: IC2.3 21.12,40.95 20.64,41.43 20.64,44.77 20.64,46.67 22.07,48.1 22.07,56.84 24.92,59.69 JP3.1
  Bottom 0.406: 21.91,59.21 C51.1 | IC7.1
  Bottom 0.61: 21.91,55.56 21.91,54.61 21.59,54.29 20.32,54.29 20,54.61 IC7.1 | 21.91,55.56 IC7.3 | JP3.1 22.38,59.69 21.91,59.21 IC7.3 21.91,55.56 | D3.C 16.3,57.26 16.03,57.31 16.03,59.21 D1.C 21.91,59.21 21.91,58.1 C51.1

### Text on the board
Top: 1 | Boot | CAN/!UART | 48 | Reset | 1 | 24 | 25
Bottom: 04/2012 | fabian
tNames: P0.0 | Vin | P0.1 | +5V | P0.2 | +3.3V | P0.3 | GND | P0.4 | GND | P0.5 | P0.6 | P0.7 | CANH | P0.8 | CANL | P0.9 | STB | P0.10 | P0.11 | P3.3 | P1.0 | P3.2 | P1.1 | P3.1 | P1.2 | P3.0 | P1.3 | P2.11 | P1.4 | P2.10 | P1.5 | P2.8 | P1.6 | P2.7 | P1.7 | P2.6 | P1.8 | P2.3 | P2.2 | P1.10 | P2.1 | P1.11 | P2.0